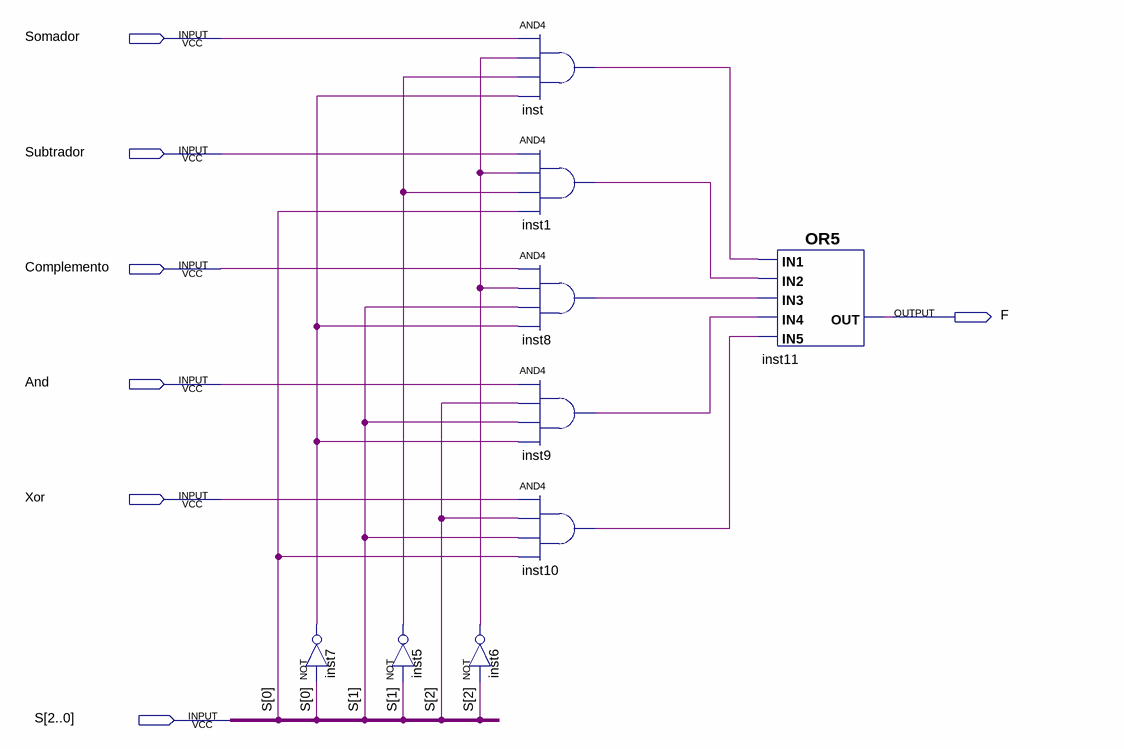
[diagram p0: schematic sheet]
// Quartus schematic MuxOp1Bit.bdf as structural Verilog: 9 symbols, 7 pins
module MuxOp1Bit (
  input  Somador,
  input  Subtrador,
  input  Complemento,
  input  And,
  input  Xor,
  input  [2:0] S,
  output F
);

  wire inst1_out, inst5_out, inst6_out, inst7_out, inst8_out, inst9_out, inst10_out, inst_out;

  not inst7 (inst7_out, S[0]);
  not inst5 (inst5_out, S[1]);
  not inst6 (inst6_out, S[2]);
  and inst (inst_out, Somador, inst6_out, inst5_out, inst7_out);
  and inst1 (inst1_out, Subtrador, inst6_out, inst5_out, S[0]);
  and inst8 (inst8_out, Complemento, inst6_out, S[1], inst7_out);
  and inst9 (inst9_out, And, S[2], S[1], inst7_out);
  and inst10 (inst10_out, Xor, S[2], S[1], S[0]);
  or inst11 (F, inst_out, inst1_out, inst8_out, inst9_out, inst10_out);
endmodule
